# Altium schematic sheet 1_MCU.SchDoc
size A4
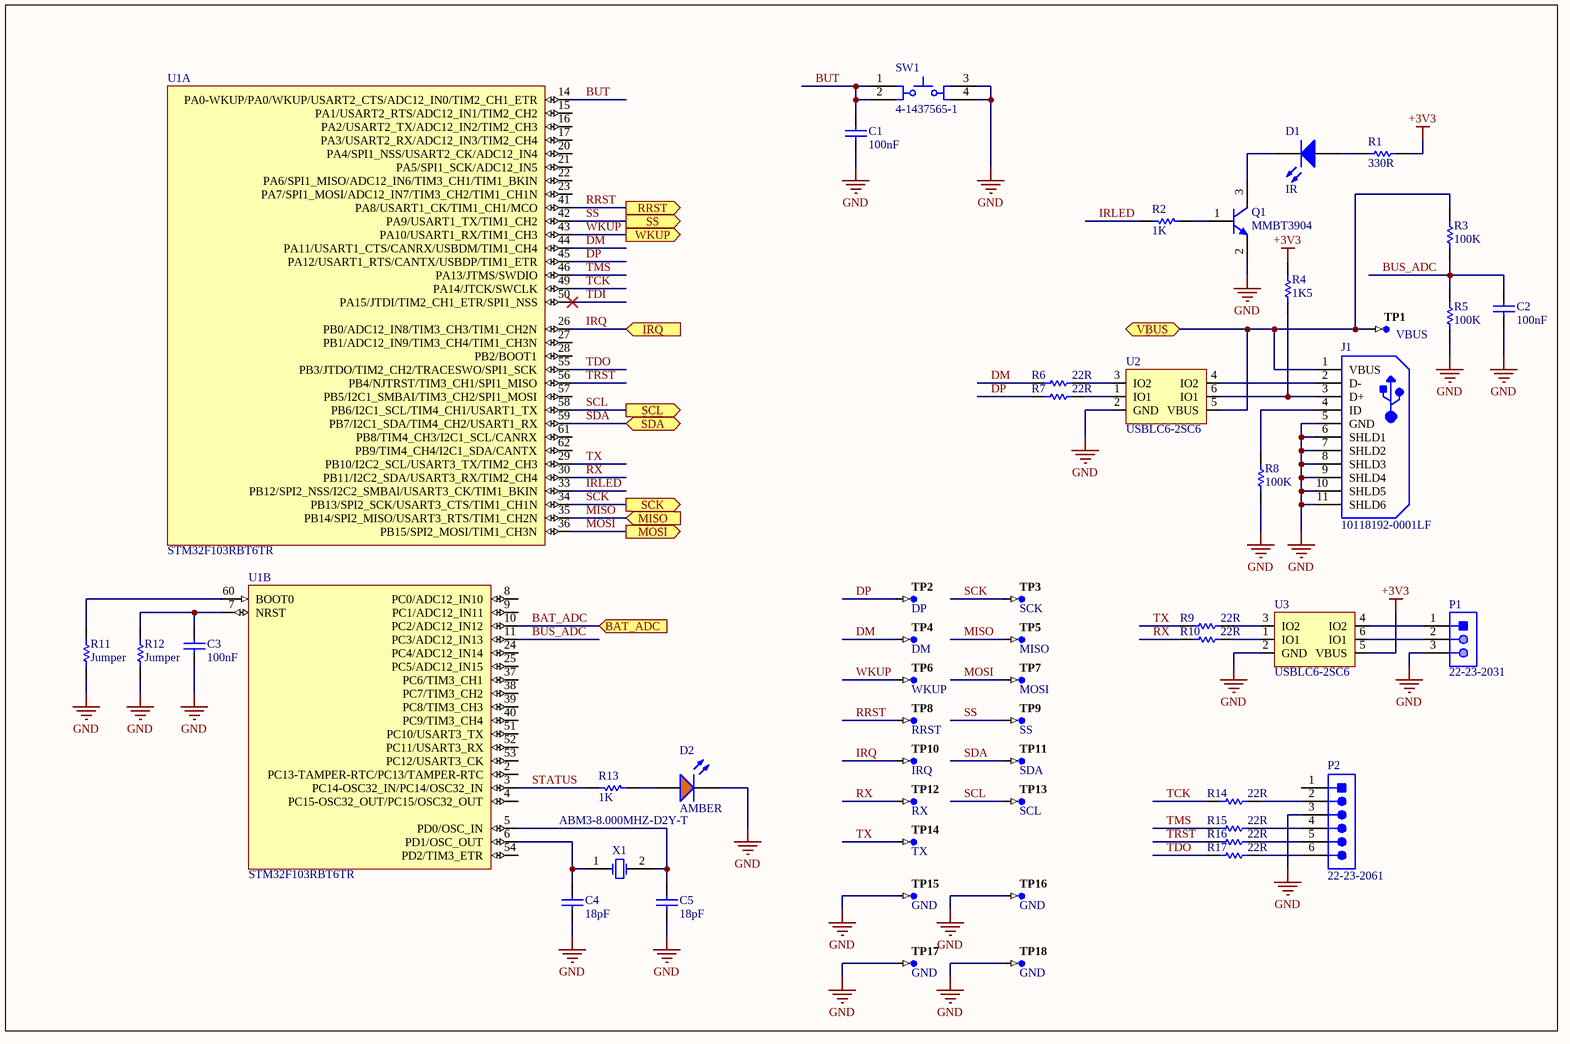
[diagram p0: 1_MCU.SchDoc]

## Parts
C1  100nF  [CAPC0603(1608)100_M]
C2  100nF  [CAPC0603(1608)100_M]
C3  100nF  [CAPC0603(1608)100_M]
C4  18pF  [CAPC0603(1608)100_M]
C5  18pF  [CAPC0603(1608)100_M]
D1  IR  [Type 3mm]
D2  AMBER  [LTST-C171AKT_V]
J1  10118192-0001LF  [FCI-10118192-0001LF-5_V]
P1  22-23-2031  [MOLX-22-23-2031_V]
P2  22-23-2061  [MOLX-22-23-2061_V]
Q1  MMBT3904  [FAIR-SOT23-3_V]
R1  330R  [RESC0603(1608)_M]
R2  1K  [RESC0603(1608)_M]
R3  100K  [RESC0603(1608)_M]
R4  1K5  [RESC0603(1608)_M]
R5  100K  [RESC0603(1608)_M]
R6  22R  [RESC0603(1608)_M]
R7  22R  [RESC0603(1608)_M]
R8  100K  [RESC0603(1608)_M]
R9  22R  [RESC0603(1608)_M]
R10  22R  [RESC0603(1608)_M]
R11  Jumper  [RESC0805(2012)_M]
R12  Jumper  [RESC0805(2012)_M]
R13  1K  [RESC0603(1608)_M]
R14  22R  [RESC0603(1608)_M]
R15  22R  [RESC0603(1608)_M]
R16  22R  [RESC0603(1608)_M]
R17  22R  [RESC0603(1608)_M]
SW1  4-1437565-1  [TECO-4-1437565-1_V]
TP1  VBUS  [TP-SM-C-100]  (no BOM)
TP2  DP  [TP-SM-C-100]  (no BOM)
TP3  SCK  [TP-SM-C-100]  (no BOM)
TP4  DM  [TP-SM-C-100]  (no BOM)
TP5  MISO  [TP-SM-C-100]  (no BOM)
TP6  WKUP  [TP-SM-C-100]  (no BOM)
TP7  MOSI  [TP-SM-C-100]  (no BOM)
TP8  RRST  [TP-SM-C-100]  (no BOM)
TP9  SS  [TP-SM-C-100]  (no BOM)
TP10  IRQ  [TP-SM-C-100]  (no BOM)
TP11  SDA  [TP-SM-C-100]  (no BOM)
TP12  RX  [TP-SM-C-100]  (no BOM)
TP13  SCL  [TP-SM-C-100]  (no BOM)
TP14  TX  [TP-SM-C-100]  (no BOM)
TP15  GND  [TP-SM-C-100]  (no BOM)
TP16  GND  [TP-SM-C-100]  (no BOM)
TP17  GND  [TP-SM-C-100]  (no BOM)
TP18  GND  [TP-SM-C-100]  (no BOM)
U1  STM32F103RBT6TR  [STM-LQFP64_N]  (parts A,B of 3)
U2  USBLC6-2SC6  [SOT95P280X145-6N]
U3  USBLC6-2SC6  [SOT95P280X145-6N]
X1  ABM3-8.000MHZ-D2Y-T  [ABRA-ABM3-2_V]

## Ports
BAT_ADC (in), IRQ (in), MISO (in), MOSI (out), RRST (out), SCK (out), SCL (out), SDA (bidir), SS (out), VBUS (bidir), WKUP (out)

## Nets
+3V3: R1.2 R4.2 U3.5(VBUS)
GND: C1.2 C2.2 C3.2 C4.1 C5.1 D2.C J1.5(GND) J1.6(SHLD1) J1.7(SHLD2) J1.8(SHLD3) J1.9(SHLD4) J1.10(SHLD5) J1.11(SHLD6) P1.3 P2.3 Q1.2(E) R5.1 R8.1 R11.1 R12.1 SW1.3 SW1.4 TP15.1 TP16.1 TP17.1 TP18.1 U2.2(GND) U3.2(GND)
BAT_ADC: U1.10(PC2/ADC12_IN12) ; port BAT_ADC
BUS_ADC: C2.1 R3.1 R5.2 U1.11(PC3/ADC12_IN13)
BUT: C1.1 SW1.1 SW1.2 U1.14(PA0-WKUP/PA0/WKUP/USART2_CTS/ADC12_IN0/TIM2_CH1_ETR)
DM: R6.1 TP4.1 U1.44(PA11/USART1_CTS/CANRX/USBDM/TIM1_CH4)
DP: R7.1 TP2.1 U1.45(PA12/USART1_RTS/CANTX/USBDP/TIM1_ETR)
IRLED: R2.2 U1.33(PB12/SPI2_NSS/I2C2_SMBAl/USART3_CK/TIM1_BKIN)
IRQ: TP10.1 U1.26(PB0/ADC12_IN8/TIM3_CH3/TIM1_CH2N) ; port IRQ
MISO: TP5.1 U1.35(PB14/SPI2_MISO/USART3_RTS/TIM1_CH2N) ; port MISO
MOSI: TP7.1 U1.36(PB15/SPI2_MOSI/TIM1_CH3N) ; port MOSI
RRST: TP8.1 U1.41(PA8/USART1_CK/TIM1_CH1/MCO) ; port RRST
RX: R10.1 TP12.1 U1.30(PB11/I2C2_SDA/USART3_RX/TIM2_CH4)
SCK: TP3.1 U1.34(PB13/SPI2_SCK/USART3_CTS/TIM1_CH1N) ; port SCK
SCL: TP13.1 U1.58(PB6/I2C1_SCL/TIM4_CH1/USART1_TX) ; port SCL
SDA: TP11.1 U1.59(PB7/I2C1_SDA/TIM4_CH2/USART1_RX) ; port SDA
SS: TP9.1 U1.42(PA9/USART1_TX/TIM1_CH2) ; port SS
STATUS: R13.2 U1.3(PC14-OSC32_IN/PC14/OSC32_IN)
TCK: R14.1 U1.49(PA14/JTCK/SWCLK)
TDI: U1.50(PA15/JTDI/TIM2_CH1_ETR/SPI1_NSS)
TDO: R17.1 U1.55(PB3/JTDO/TIM2_CH2/TRACESWO/SPI1_SCK)
TMS: R15.1 U1.46(PA13/JTMS/SWDIO)
TRST: R16.1 U1.56(PB4/NJTRST/TIM3_CH1/SPI1_MISO)
TX: R9.1 TP14.1 U1.29(PB10/I2C2_SCL/USART3_TX/TIM2_CH3)
VBUS: J1.1(VBUS) R3.2 TP1.1 U2.5(VBUS) ; port VBUS
WKUP: TP6.1 U1.43(PA10/USART1_RX/TIM1_CH3) ; port WKUP
NetC3_1: C3.1 R12.2 U1.7(NRST)
NetC4_2: C4.2 U1.6(PD1/OSC_OUT) X1.1(X1)
NetC5_2: C5.2 U1.5(PD0/OSC_IN) X1.2(X2)
NetD1_1: D1.1(K) Q1.3(C)
NetD1_2: D1.2(A) R1.1
NetD2_A: D2.A R13.1
NetJ1_2: J1.2(D-) U2.4(IO2)
NetJ1_3: J1.3(D+) R4.1 U2.6(IO1)
NetJ1_4: J1.4(ID) R8.2
NetP1_1: P1.1 U3.4(IO2)
NetP1_2: P1.2 U3.6(IO1)
NetP2_2: P2.2 R14.2
NetP2_4: P2.4 R15.2
NetP2_5: P2.5 R16.2
NetP2_6: P2.6 R17.2
NetQ1_1: Q1.1(B) R2.1
NetR6_2: R6.2 U2.3(IO2)
NetR7_2: R7.2 U2.1(IO1)
NetR9_2: R9.2 U3.3(IO2)
NetR10_2: R10.2 U3.1(IO1)
NetR11_2: R11.2 U1.60(BOOT0)

Not connected (* = marked no-connect by the designer): P2 1; U1 2(PC13-TAMPER-RTC/PC13/TAMPER-RTC) 4(PC15-OSC32_OUT/PC15/OSC32_OUT) 8(PC0/ADC12_IN10) 9(PC1/ADC12_IN11) 15(PA1/USART2_RTS/ADC12_IN1/TIM2_CH2) 16(PA2/USART2_TX/ADC12_IN2/TIM2_CH3) 17(PA3/USART2_RX/ADC12_IN3/TIM2_CH4) 20(PA4/SPI1_NSS/USART2_CK/ADC12_IN4) 21(PA5/SPI1_SCK/ADC12_IN5) 22(PA6/SPI1_MISO/ADC12_IN6/TIM3_CH1/TIM1_BKIN) 23(PA7/SPI1_MOSI/ADC12_IN7/TIM3_CH2/TIM1_CH1N) 24(PC4/ADC12_IN14) 25(PC5/ADC12_IN15) 27(PB1/ADC12_IN9/TIM3_CH4/TIM1_CH3N) 28(PB2/BOOT1) 37(PC6/TIM3_CH1) 38(PC7/TIM3_CH2) 39(PC8/TIM3_CH3) 40(PC9/TIM3_CH4) 51(PC10/USART3_TX) 52(PC11/USART3_RX) 53(PC12/USART3_CK) 54(PD2/TIM3_ETR) 57(PB5/I2C1_SMBAI/TIM3_CH2/SPI1_MOSI) 61(PB8/TIM4_CH3/I2C1_SCL/CANRX) 62(PB9/TIM4_CH4/I2C1_SDA/CANTX)

## Library data of the parts
C1-C3 = CMP-1035-02589-1: CAP 100nF 25V ±20% 0603 (1608 Metric) Thickness 1mm SMD; Case-EIA: 0603; Tolerance: Â±20%; Case-Metric: 1608; Value: 100nF; Max Thickness: 1 mm; Technology: SMT; Rated Voltage: 25 V
C4 C5 = CMP-1035-00741-1: CAP 18pF 25V ±0.5pF 0603 (1608 Metric) Thickness 1mm SMD; Case-Metric: 1608; Case-EIA: 0603; Tolerance: Â±0.5pF; Value: 18pF; Rated Voltage: 25 V; Technology: SMT; Max Thickness: 1 mm
D1 = CMP-1488-00005-1: THT LED round mono-color color lens, WL-TMRW, Super Red; PartNumber: 151031SS04000; Manufacturer: Wuerth Elektronik; ComponentLink2Description: Datasheet; ComponentLink1URL: http://www.we-online.com; ComponentLink1Description: Manufacturer URL; PackageReference: Type 3mm; ComponentLink2URL: http://katalog.we-online.de/pbs/datasheet/7448042001.pdfhttp://katalog.we-online.de/pbs/datasheet/7448042001.pdfhttp://katalog.we-online.de/pbs/datasheet/7448042001.pdfhttp://katalog.we-online.de/pbs/datasheet/151031SS04000.pdf; Emitting color: Super Red
D2 = CMP-1674-00004-3: LED AMBER CLR THIN 0805 SMD; PartNumber: LTST-C171AKT; Manufacturer: Lite-On; ComponentLink1URL: http://optoelectronics.liteon.com/upload/download/DS-22-99-0170/S_110_LTST-C171AKT.pdf; PackageReference: C171AKT; ComponentLink1Description: Datasheet
J1 = CMP-2000-05118-1: Micro USB B Type Receptacle, -55 to 85 degC, 5-Pin SMD, RoHS, Tape and Reel; Manufacturer: FCI; Current Rating: 1.8A; Number of Contacts: 5Contact; Mounting Angle: Right; Insulation Resistance: 1000MOhms; Connector Type: MicroUSBTypeBreceptacle; Gender: Female; Packaging: Reel; Termination Style: SMD/SMT; Product Category: USBConnectors; RoHS: Details; Flammability Rating: UL94V-0; Standard: USB2.0; Brand: FCI; Manufacturer URL: http://www.fci.com/; Product: MicroUSBTypeBConnectors; Operating Temperature Range: -55Cto+85C; Datasheet Version: Rev. B, 05/2015; Contact Material: CopperAlloy; Contact Plating: Gold; Datasheet URL: http://www.mouser.com/ds/2/154/10118192-793027.pdf; Color: Black; Factory Pack Quantity: 1400
P1 = CMP-2000-05242-1: Male Header, Pitch 2.54 mm, 1 x 3 Position, Height 8.18 mm, Tail Length 3.56 mm, RoHS, Bulk; Current Rating: 4A; Brand: Molex; Pitch: 2.54mm; Voltage Rating: 250V; Mounting Angle: Vertical; Type: Locking; Factory Pack Quantity: 16000; Tradename: KK; Housing Material: Nylon; Contact Material: Brass; Manufacturer URL: http://www.molex.com/; Termination Style: ThroughHole; Mounting Style: ThroughHole; Number of Positions: 3Position; Contact Gender: Pin(Male); Packaging: Bulk; Series: 6373; Datasheet Version: Sep-01; Contact Plating: Tin; Product: Headers; Datasheet URL: https://datasheet.ciiva.com/19472/232274-19472863.pdf; RoHS: Details; Product Category: Headers&WireHousings; Manufacturer: Molex; Number of Rows: 1Row
P2 = CMP-2000-05536-1: Male Header, Pitch 2.54 mm, 1 x 6 Position, Height 10.67 mm, Tail Length 3.56 mm, 0 to 70 degC, RoHS, Bulk; Manufacturer: Molex; Pitch: 2.54mm; Mounting Angle: Vertical; Current Rating: 4A; Number of Positions / Contacts: 6; Voltage Rating: 250V; Packaging: Bulk; Package Description: Male Header, Pitch 2.54 mm, 1 x 6 Position, Height 10.67 mm, Tail Length 3.56 mm; Number of Rows: 1; Type: PinStrip; Contact Material: Brass; Product Category: .100K.K.Connectors; Factory Pack Quantity: 1000; Mounting Style: ThroughHole; RoHS: Details; Contact Plating: Tin; Housing Material: Nylon; Mounting Technology: ThroughHole; Termination Style: ThroughHole; Tradename: KK; Number of Positions: 6; Brand: Molex; Product Type: Headers; Series: 6373; Datasheet URL: https://datasheet.ciiva.com/19460/232303-19460895.pdf; Package Reference: 22-23-2061; Datasheet Version: Rev. P, 09/2001; Manufacturer URL: http://www.molex.com/
Q1 = CMP-1670-00008-1: NPN General Purpose Amplifier, 40 V, 0.2 A, -55 to 150 degC, 3-Pin SOT23, RoHS, Tape and Reel; Tolerance: 30ppm; Capacitance: 1.8E-11 f; Frequency: 12.288 MHz; ESR: 40 Ohm; Load Capacitance: 18 pF; REACH SVHC: No SVHC; Pins: 4; ComponentLink3URL: http://www.fairchildsemi.com/dwg/MA/MA03D.pdf; PackageDescription: 3-Pin Small Outline Transistor, Body 2.92 x 1.325 mm, Pitch 0.95 mm; ComponentLink1URL: https://www.fairchildsemi.com/; Max Operating Temperature: 70degC; PackageReference: SOT23-3; ComponentLink1Description: Manufacturer URL; Width: 0.126 inch; Min Operating Temperature: -20degC; DatasheetVersion: Rev. 1.1.0, 10/2014; Mount: Surface Mount; Height: 0.041 inch; Package Quantity: 1000; Frequency Tolerance: 30ppm; Packaging: Tape and Reel; ComponentLink2URL: https://www.fairchildsemi.com/datasheets/MM/MMBT3904.pdf; RoHSCompliant: True; ComponentLink3Description: Package Specification; ComponentLink2Description: Datasheet; Length: 0.197 inch
R1 = CMP-1012-00454-1: 330R 0.1W 1% 0603 (1608 Metric)  SMD; Case-Metric: 1608; Value: 330.00 Ohm; Case-EIA: 0603; Tolerance: 1 %; Technology: SMT; Power: 0.1 W
R2 R13 = CMP-1012-00510-1: 1K 0.1W 1% 0603 (1608 Metric)  SMD; Case-Metric: 1608; Case-EIA: 0603; Value: 1000.00 Ohm; Technology: SMT; Tolerance: 1 %; Power: 0.1 W
R3 R5 R8 = CMP-1012-00736-1: 100K 0.1W 1% 0603 (1608 Metric)  SMD; Value: 100000.00 Ohm; Case-Metric: 1608; Case-EIA: 0603; Power: 0.1 W; Tolerance: 1 %; Technology: SMT
R4 = CMP-1012-00528-1: 1K5 0.1W 1% 0603 (1608 Metric)  SMD; Case-EIA: 0603; Value: 1500.00 Ohm; Case-Metric: 1608; Power: 0.1 W; Technology: SMT; Tolerance: 1 %
R6 R7 R9 R10 R14-R17 = CMP-1012-00320-1: 22R 0.1W 1% 0603 (1608 Metric)  SMD; Value: 22.00 Ohm; Case-EIA: 0603; Case-Metric: 1608; Power: 0.1 W; Technology: SMT; Tolerance: 1 %
R11 R12 = CMP-1013-00001-1: Jumper 0805 (2012 Metric); Case-EIA: 0805; Value: 0.00 Ohm; Tolerance: None; Case-Metric: 2012; Technology: SMT; Power: None
SW1 = CMP-2000-05602-1: Tactile Switch, 50 mA, 12 VDC, -20 to 85 degC, 4-Pin SMD, RoHS, Bulk; Manufacturer: TEConnectivity/AMPBrand; Illumination Type: N/R; Maximum Contact Resistance: 100mOhm; Actuator Style: RoundButton; Actuator Length: 1.4mm; Contact Rating @ Voltage: 0.05@12VDCA; Maximum DC Voltage Rating: 12V; Body Orientation: Straight; Ground Terminal: No; Dielectric Strength: 500VAC; Operating Force: 1.57N; Electrical Life: 100000Cycle; Mechanical Life: N/A; Family: FSMJSMA; Contact Material: CopperAlloy; Type: N/A; RoHS: Yes; Pole Throw Configuration: N/A; Operating Temperature: -20to85C; Minimum Insulation Resistance: 100MOhm; Package Description: 4-Pin Surface Mount Device, Body 6 x 6 mm, Pitch 9.1 mm; Housing Material: N/A; Switch Configuration: N/A; Mounting: SurfaceMount,GullWing; Datasheet URL: https://datasheet.ciiva.com/14635/0900766b80912216-14635826.pdf; Packaging: Bulk; Base Material: N/A; Actuator Color: N/A; Dimension: 6x10x5.25mm; Contact Plating: Silver; Seal Location: N/A; Mounting Technology: SurfaceMount; Part No: 4-1437565-1; Seal Description: N/A; Maximum AC Voltage Rating: N/A; Datasheet Version: 04/2007; Manufacturer URL: http://www.te.com/; Package Reference: 4-1437565-1; Product Weight: N/A
TP1-TP18 = CMP-0484-00002-2: Test Point, Surface Mount, Circular, Pad Diameter 1 mm; Manufacturer: No Vendor; PartNumber: TP-SM-C-100
U1 = CMP-0237-00169-2: ARM Cortex-M3 32-bit MCU, 128 KB Flash, 20 KB Internal RAM, 51 I/Os, 64-pin LQFP, -40 to 85 degC, Tape and Reel; Supply Voltage(Vcc) min (V): 2; A/D Converter: 2x12-bit (16 Channel); FLASH Size (Prog) (kB): 128; I/Os (High Current): 51; Operating Frequency(F) (Processor speed) (MHz): 72; Internal RAM Size (kB): 20; ComponentLink2URL: http://www.st.com/st-web-ui/static/active/en/resource/technical/document/datasheet/CD00161566.pdf; ComponentLink2Description: Datasheet; ComponentLink1Description: Manufacturer URL; Packing: Tape and Reel; PackageReference: LQFP64; ComponentLink1URL: http://www.st.com/web/en/home.html; Mounting Technology: Surface Mount; DatasheetVersion: Rev. 16; PartNumber: STM32F103RBT6TR; Core: ARM Cortex-M3; ComponentLink3URL: http://www.st.com/st-web-ui/static/active/en/resource/technical/document/datasheet/DM00037051.pdf; PackageDescription: 64-Pin Low Profile Quad Flat Package, 10 x 10 mm Body, 0.5 mm Pitch; PackageVersion: Rev. 4, 06/2013; ComponentLink3Description: Package Specification; PartId: 1
U2 U3 = USBLC6-2SC6: TVS DIODE 5.25V 17V SOT23-6; Manufacturer: STMicroelectronics; Direction: Unidirectional; Capacitance: 3.5pF; Number of Bidirectional Channels: 2; Min Breakdown Voltage: 6V; Power Line Protection: Yes; Leakage Current: 150nA; Peak Pulse Current: 5A; Operating Supply Voltage: 1.1V; Test Current: 1mA; Number of Elements: 1; Working Voltage: 5V; Element Configuration: Dual; Data Rate: 480Mbps; Supplier 1: Digi-Key; Manufacturer Part Number: USBLC6-2SC6; Stock 1: 85571; Pricing 1: 1 = 0,49000, 10 = 0,41900, 100 = 0,31310, 500 = 0,24602, 1000 = 0,19010 (USD); RoHS: Yes; Mount: Surface Mount; Case/Package: SOT-23; Number of Pins: 6; Contact Plating: Tin; Min Operating Temperature: -40°C; Max Operating Temperature: 125°C; Packaging: Tape and Reel; Package Quantity: 3000; Clamping Voltage: 17V; Reverse Standoff Voltage: 5.25V; Number of Channels: 2; Breakdown Voltage: 6V; Termination: SMD/SMT; ESD Protection: Yes; Max Reverse Leakage Current: 150nA; Reverse Breakdown Voltage: 6V; Polarity: Unidirectional; Max Breakdown Voltage: 6V; Length: 3.05mm; Height: 1.3mm; Depth: 1.75mm; Width: 1.75mm; Radiation Hardening: No; Lead Free: Lead Free; REACH SVHC: No SVHC; ComponentLink1URL: https://datasheet.ciiva.com/1268/1690354-1268384.pdf?src-supplier=Element14; ComponentLink1Description: https://datasheet.ciiva.com/1268/1690354-1268384.pdf?src-supplier=Element14; ComponentLink2URL: https://datasheet.ciiva.com/4508/cd00050750-113117-4508433.pdf?src-supplier=Mouser; ComponentLink2Description: https://datasheet.ciiva.com/4508/cd00050750-113117-4508433.pdf?src-supplier=Mouser; ComponentLink3URL: https://datasheet.ciiva.com/15143/getdatasheetpartid-148465-15143789.pdf?src-supplier=Verical; ComponentLink3Description: https://datasheet.ciiva.com/15143/getdatasheetpartid-148465-15143789.pdf?src-supplier=Verical; ComponentLink4URL: https://datasheet.ciiva.com/26787/usblc6-2sc6-26787908.pdf?src-supplier=IIIC; ComponentLink4Description: https://datasheet.ciiva.com/26787/usblc6-2sc6-26787908.pdf?src-supplier=IIIC; ComponentLink5URL: https://datasheet.ciiva.com/16200/cd00050750-16200026.pdf?src-supplier=Future+Electronics; ComponentLink5Description: https://datasheet.ciiva.com/16200/cd00050750-16200026.pdf?src-supplier=Future+Electronics; ComponentLink6URL: https://datasheet.ciiva.com/41444/001184109-da-01-en-ic-esd-protecti-usblc6-2sc6-sot-23-6-stm-41444156.pdf?src-supplier=Conrad; ComponentLink6Description: https://datasheet.ciiva.com/41444/001184109-da-01-en-ic-esd-protecti-usblc6-2sc6-sot-23-6-stm-41444156.pdf?src-supplier=Conrad
X1 = CMP-2000-05033-1: Miniature Ceramic Crystal, 8 MHz, -40 to 85 degC, 2-Pin SMD, RoHS, Tape and Reel; Manufacturer: ABRACON; Case Length: 5mm; Case Width: 3.2mm; Case Height: 1.3mm; Load Capacitance: 18pF; Frequency: 8MHz; Frequency Stability: 30PPM; ESR: 140Ohms; Tolerance: 20PPM; Type: MiniatureCeramicCrystal; Factory Pack Quantity: 1000; Package / Case: 5mmx3.2mm; Mounting Style: SMD/SMT; Manufacturer URL: http://www.abracon.com/; RoHS: Details; Dimensions: 3.2mmWx5mmLx1.3mmH; Datasheet URL: http://www.farnell.com/datasheets/1754353.pdf; Brand: ABRACON; Packaging: Reel; Product Category: Crystals; Package Description: 2-Pin Surface Mount Device, Body 5 x 3.2 mm; Package URL: http://www.abracon.com/Support/PackageDrawing/Resonators/ABM3.PDF; Operating Temperature Range: -40Cto+85C; Termination Style: SMD/SMT; Datasheet Version: Sep-13; Series: ABM3; Package Reference: ABM3-2